# Altium schematic sheet Reference_Layout.SchDoc
size C; SheetNumber: 6; SheetTotal: 6
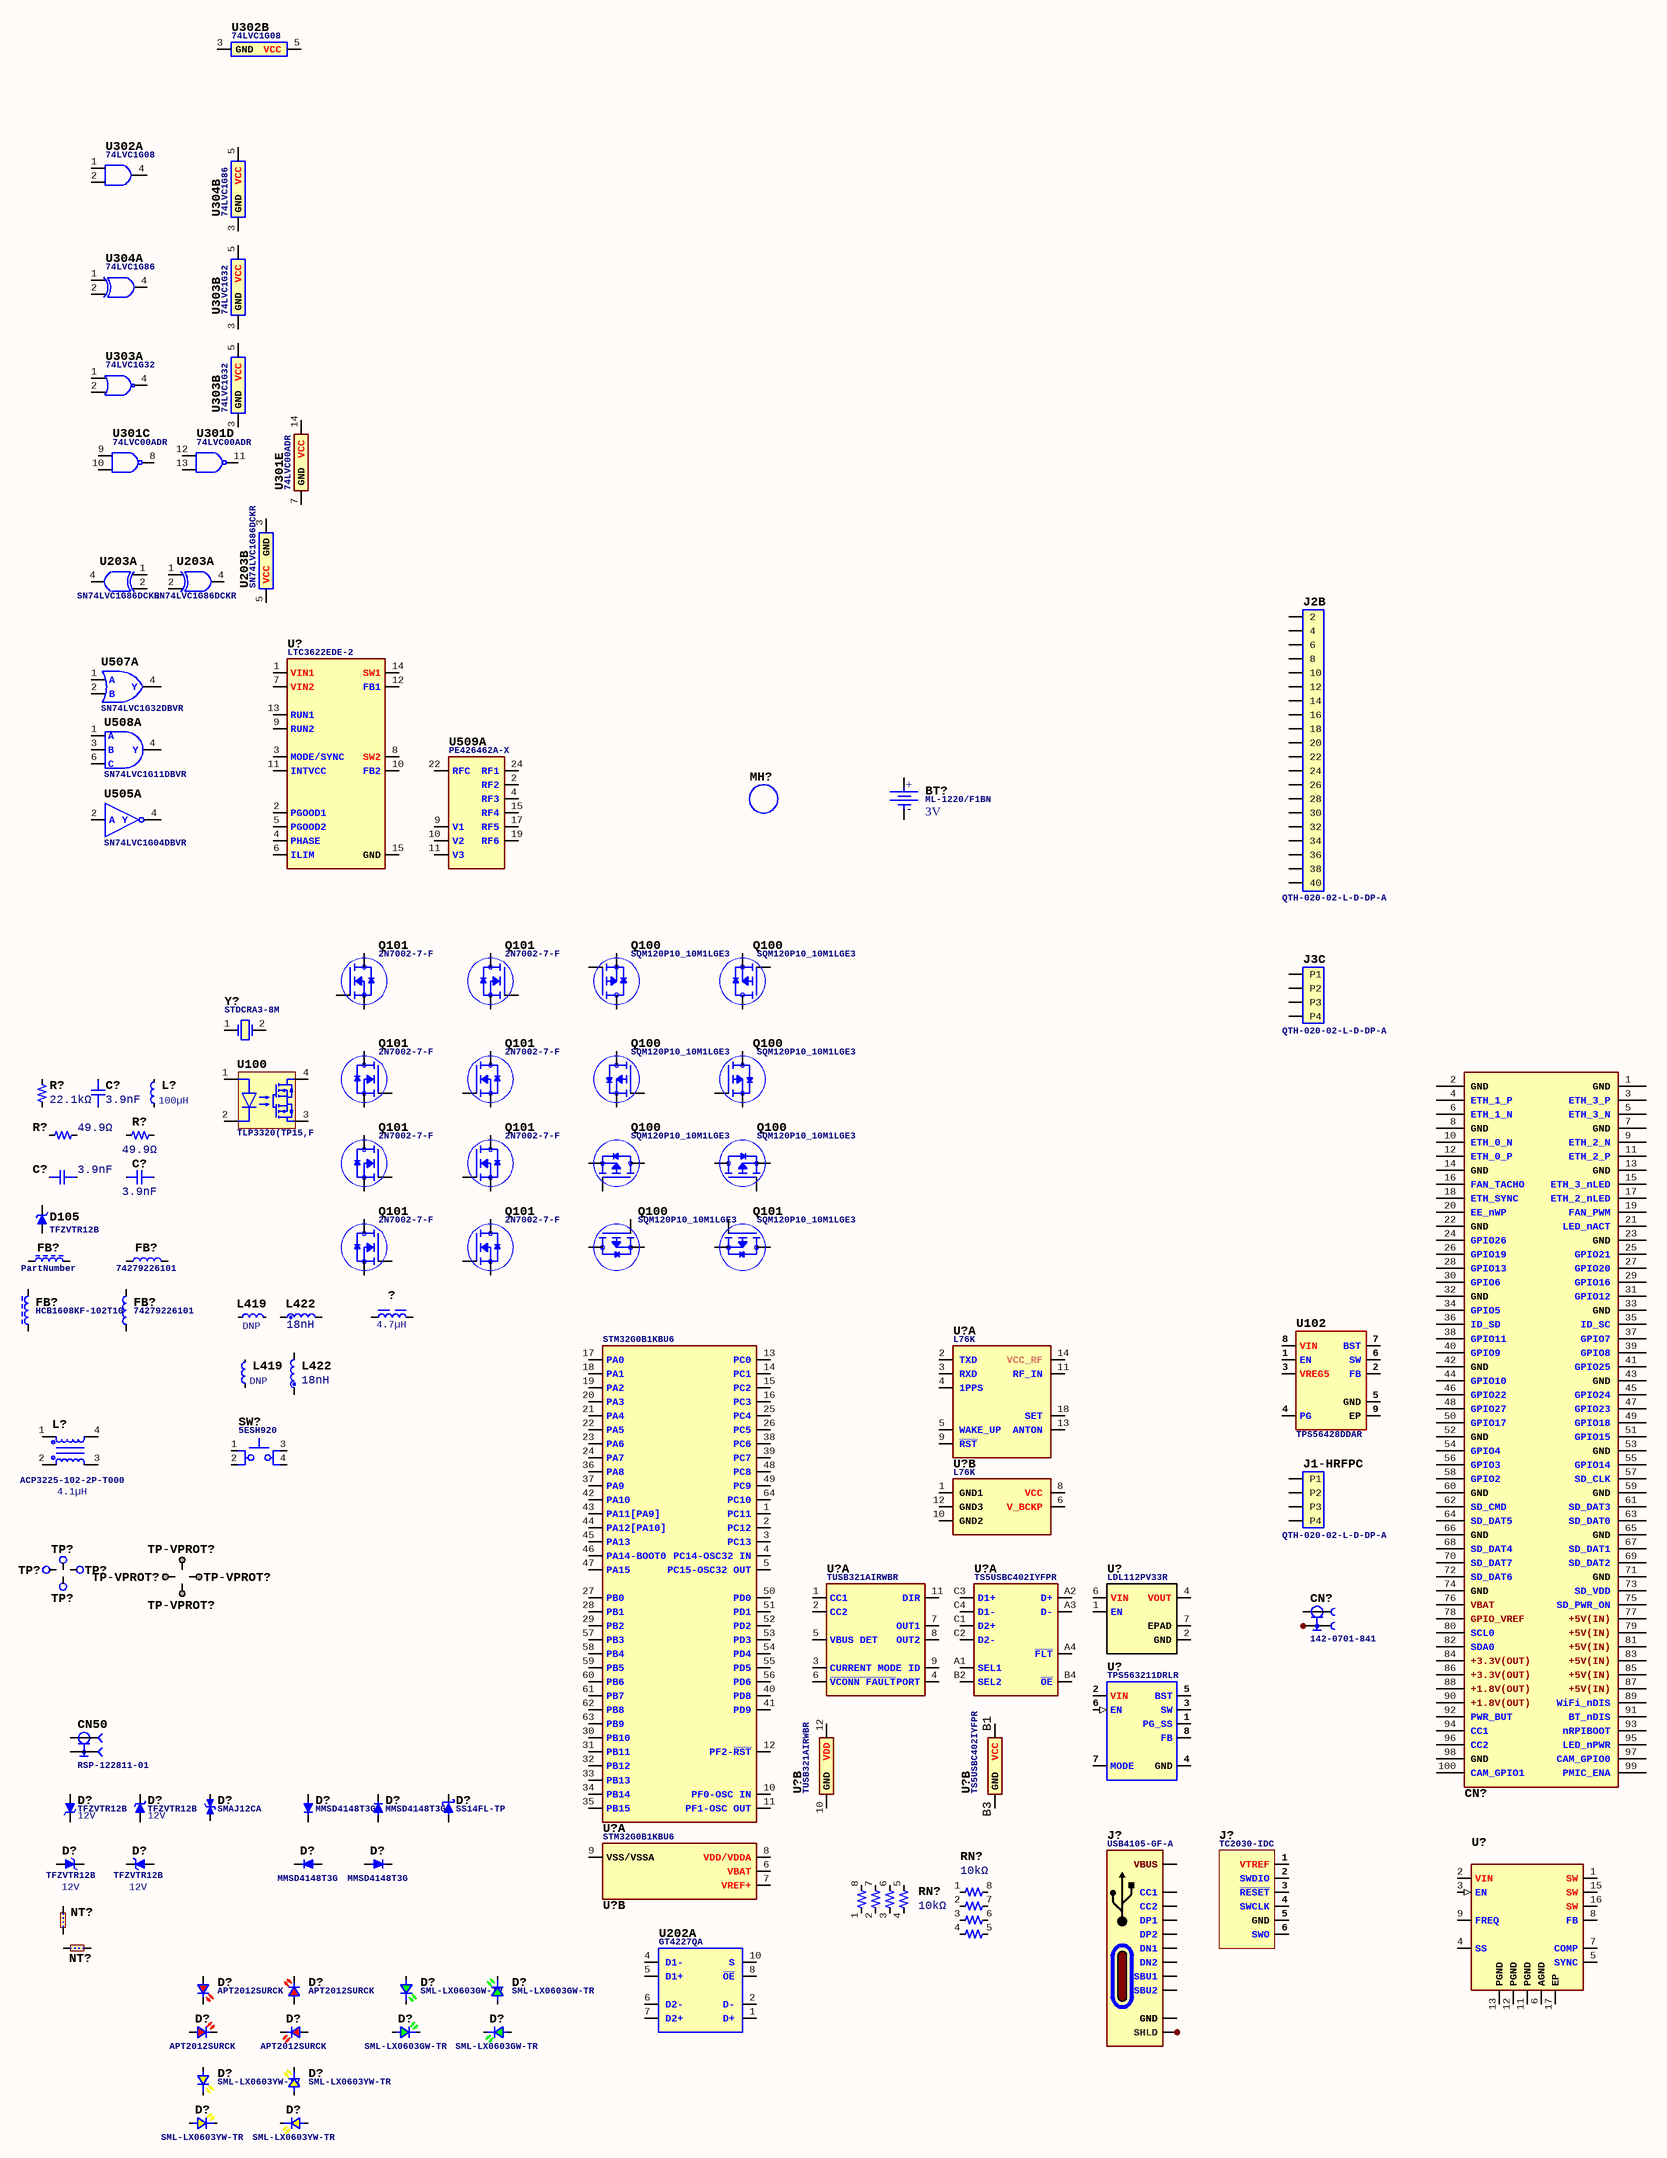
[diagram p0: Reference_Layout.SchDoc]

## Parts
(Parts that share a designator on the sheet are numbered #1, #2 ... from top to bottom, then left to right.)
?  Inductance: 4.7µH  [WE-HCI_7040]  (hidden comment: MN-IND-4.7µH-744311470)
BT?  Voltage: 3V  PartNumber: ML-1220/F1BN  [FP-ML-1220-F1BN-MFG]  (hidden comment: MN-BAT-LITH-ML-1220/F1BN)
C?#1  Capacitance: 3.9nF  [CAPC0805(2012)145_L]  (hidden comment: MN-CAP-CERM-C0G-0805-3.9nF-50V-5%)
C?#2  Capacitance: 3.9nF  [CAPC0805(2012)145_L]  (hidden comment: MN-CAP-CERM-C0G-0805-3.9nF-50V-5%)
C?#3  Capacitance: 3.9nF  [CAPC0805(2012)145_L]  (hidden comment: MN-CAP-CERM-C0G-0805-3.9nF-50V-5%)
CN50  PartNumber: RSP-122811-01  [MN-FP-UF.L-SAMTEC_RSP-122811-01-Footprint-1]  (hidden comment: MN-CON-U.FL-RSP-122811-01)
CN?#1  MN-SOM-RPI-CM5  [RPi-CM5-Footprint]  (value not drawn)
CN?#2  PartNumber: 142-0701-841  [MN-PCB-142-0701-841-Footprint-1]  (hidden comment: MN-CON-SMA-142-0701-841)
D105  PartNumber: TFZVTR12B  [SOD-323HE]  (hidden comment: MN-DIO-ZENER-12V)
D?#1  PartNumber: TFZVTR12B  Zener Voltage: 12V  [SOD-323HE]  (hidden comment: MN-DIO-ZENER-12V)
D?#2  PartNumber: MMSD4148T3G  [FP-SOD-123]  (hidden comment: MN-DIO-MMSD4148T3G)
D?#3  PartNumber: SMAJ12CA  [FP-DO-214AC-SMAJ]  (hidden comment: MN-DIO-TVS-SMAJ12CA)
D?#4  PartNumber: TFZVTR12B  Zener Voltage: 12V  [SOD-323HE]  (hidden comment: MN-DIO-ZENER-12V)
D?#5  PartNumber: MMSD4148T3G  [FP-SOD-123]  (hidden comment: MN-DIO-MMSD4148T3G)
D?#6  PartNumber: SS14FL-TP  [FP-DO-221AC]  (hidden comment: MN-DIO-SCHOTTKY-SS14FL-TP)
D?#7  PartNumber: TFZVTR12B  Zener Voltage: 12V  [SOD-323HE]  (hidden comment: MN-DIO-ZENER-12V)
D?#8  PartNumber: TFZVTR12B  Zener Voltage: 12V  [SOD-323HE]  (hidden comment: MN-DIO-ZENER-12V)
D?#9  PartNumber: MMSD4148T3G  [FP-SOD-123]  (hidden comment: MN-DIO-MMSD4148T3G)
D?#10  PartNumber: MMSD4148T3G  [FP-SOD-123]  (hidden comment: MN-DIO-MMSD4148T3G)
D?#11  PartNumber: APT2012SURCK  [LEDC2012X05N]  (hidden comment: MN-LED-0805-RED)
D?#12  PartNumber: SML-LX0603GW-TR  [LEDC1608X08N]  (hidden comment: MN-LED-0602-GRN)
D?#13  PartNumber: APT2012SURCK  [LEDC2012X05N]  (hidden comment: MN-LED-0805-RED)
D?#14  PartNumber: SML-LX0603GW-TR  [LEDC1608X08N]  (hidden comment: MN-LED-0602-GRN)
D?#15  PartNumber: APT2012SURCK  [LEDC2012X05N]  (hidden comment: MN-LED-0805-RED)
D?#16  PartNumber: APT2012SURCK  [LEDC2012X05N]  (hidden comment: MN-LED-0805-RED)
D?#17  PartNumber: SML-LX0603GW-TR  [LEDC1608X08N]  (hidden comment: MN-LED-0602-GRN)
D?#18  PartNumber: SML-LX0603GW-TR  [LEDC1608X08N]  (hidden comment: MN-LED-0602-GRN)
D?#19  PartNumber: SML-LX0603YW-TR  [LEDC1608X08N]  (hidden comment: MN-LED-0602-YEL)
D?#20  PartNumber: SML-LX0603YW-TR  [LEDC1608X08N]  (hidden comment: MN-LED-0602-YEL)
D?#21  PartNumber: SML-LX0603YW-TR  [LEDC1608X08N]  (hidden comment: MN-LED-0602-YEL)
D?#22  PartNumber: SML-LX0603YW-TR  [LEDC1608X08N]  (hidden comment: MN-LED-0602-YEL)
FB?#1  MN-FB-1A-1KΩ-100MHz  [FP-BLM18-0_15-t0_8-IPC_B]  (value not drawn)
FB?#2  PartNumber: 74279226101  [WE-MPSB_1812_L4.5W3.2H2.3]  (hidden comment: MN-IND-FB-74279226101)
FB?#3  PartNumber: HCB1608KF-102T10  [FP-BLM18-0_15-t0_8-IPC_B]  (hidden comment: MN-FB-1A-1KΩ-100MHz)
FB?#4  PartNumber: 74279226101  [WE-MPSB_1812_L4.5W3.2H2.3]  (hidden comment: MN-IND-FB-74279226101)
J1-HRFP  PartNumber: QTH-020-02-L-D-DP-A  [FP-QTH-020-02-L-D-DP-A-MFG_16mm]  (hidden comment: MN-CON-SAMTEC-QTH-020-02-L-D-DP-A)  (part C of 3)
J2  PartNumber: QTH-020-02-L-D-DP-A  [FP-QTH-020-02-L-D-DP-A-MFG_16mm]  (hidden comment: MN-CON-SAMTEC-QTH-020-02-L-D-DP-A)  (part B of 3)
J3  PartNumber: QTH-020-02-L-D-DP-A  [FP-QTH-020-02-L-D-DP-A-MFG_16mm]  (hidden comment: MN-CON-SAMTEC-QTH-020-02-L-D-DP-A)  (part C of 3)
J?#1  PartNumber: USB4105-GF-A  [MN-CON-USB-USB4105-GF-A-Footprint-1]  (hidden comment: MN-CON-USB-USB4105-GF-A)
J?#2  PartNumber: TC2030-IDC  [TC2030-IDC-Footprint]  (hidden comment: MN-CON-DBG-TC2030-IDC)  (no BOM)
L419#1  Inductance: DNP  [FP-IND_0805]  (hidden comment: MN-IND-DNP-0805)
L419#2  Inductance: DNP  [FP-IND_0805]  (hidden comment: MN-IND-DNP-0805)
L422#1  Inductance: 18nH  [FP-INDC0201(0603)_N]  (hidden comment: MN-IND-18nH-0201)
L422#2  Inductance: 18nH  [FP-INDC0201(0603)_N]  (hidden comment: MN-IND-18nH-0201)
L?#1  value 100µH  [FP-IND_0805]  (hidden comment: MN-IND-100µH-0805)
L?#2  PartNumber: ACP3225-102-2P-T000  Inductance: 4.1µH  [FP-ACP3225-MFG]  (hidden comment: MN-IND-ACP3225-102-2P-T000)
MH?  MN-PCB-MH-M3-PLATED  [PCB_MH_M3-PLATED-Footprint-1]  (value not drawn)  (no BOM)
NT?#1  MN-PCB-NETTIE  [Net-Tie_10milWide_30milLong]  (value not drawn)  (net tie, no BOM)
NT?#2  MN-PCB-NETTIE  [Net-Tie_10milWide_30milLong]  (value not drawn)  (net tie, no BOM)
Q100#1  PartNumber: SQM120P10_10M1LGE3  [FP-TO-263-3, D2PAK]  (hidden comment: MN-TRN-MOSFET-P_CH-100V-120A-SQM120P10_10M1LGE3)
Q100#2  PartNumber: SQM120P10_10M1LGE3  [FP-TO-263-3, D2PAK]  (hidden comment: MN-TRN-MOSFET-P_CH-100V-120A-SQM120P10_10M1LGE3)
Q100#3  PartNumber: SQM120P10_10M1LGE3  [FP-TO-263-3, D2PAK]  (hidden comment: MN-TRN-MOSFET-P_CH-100V-120A-SQM120P10_10M1LGE3)
Q100#4  PartNumber: SQM120P10_10M1LGE3  [FP-TO-263-3, D2PAK]  (hidden comment: MN-TRN-MOSFET-P_CH-100V-120A-SQM120P10_10M1LGE3)
Q100#5  PartNumber: SQM120P10_10M1LGE3  [FP-TO-263-3, D2PAK]  (hidden comment: MN-TRN-MOSFET-P_CH-100V-120A-SQM120P10_10M1LGE3)
Q100#6  PartNumber: SQM120P10_10M1LGE3  [FP-TO-263-3, D2PAK]  (hidden comment: MN-TRN-MOSFET-P_CH-100V-120A-SQM120P10_10M1LGE3)
Q100#7  PartNumber: SQM120P10_10M1LGE3  [FP-TO-263-3, D2PAK]  (hidden comment: MN-TRN-MOSFET-P_CH-100V-120A-SQM120P10_10M1LGE3)
Q101#1  PartNumber: 2N7002-7-F  [NXP-SOT23-3_V]  (hidden comment: MN-TRN-MOSFET-N_CH_60V-115mA-2N7002-7-F)
Q101#2  PartNumber: 2N7002-7-F  [NXP-SOT23-3_V]  (hidden comment: MN-TRN-MOSFET-N_CH_60V-115mA-2N7002-7-F)
Q101#3  PartNumber: 2N7002-7-F  [NXP-SOT23-3_V]  (hidden comment: MN-TRN-MOSFET-N_CH_60V-115mA-2N7002-7-F)
Q101#4  PartNumber: 2N7002-7-F  [NXP-SOT23-3_V]  (hidden comment: MN-TRN-MOSFET-N_CH_60V-115mA-2N7002-7-F)
Q101#5  PartNumber: 2N7002-7-F  [NXP-SOT23-3_V]  (hidden comment: MN-TRN-MOSFET-N_CH_60V-115mA-2N7002-7-F)
Q101#6  PartNumber: 2N7002-7-F  [NXP-SOT23-3_V]  (hidden comment: MN-TRN-MOSFET-N_CH_60V-115mA-2N7002-7-F)
Q101#7  PartNumber: SQM120P10_10M1LGE3  [FP-TO-263-3, D2PAK]  (hidden comment: MN-TRN-MOSFET-P_CH-100V-120A-SQM120P10_10M1LGE3)
Q101#8  PartNumber: 2N7002-7-F  [NXP-SOT23-3_V]  (hidden comment: MN-TRN-MOSFET-N_CH_60V-115mA-2N7002-7-F)
Q101#9  PartNumber: 2N7002-7-F  [NXP-SOT23-3_V]  (hidden comment: MN-TRN-MOSFET-N_CH_60V-115mA-2N7002-7-F)
R?#1  Resistance: 22.1kΩ  [RESC0402(1005)]  (hidden comment: MN-RES-0402-22.1KΩ-1/10W)
R?#2  Resistance: 49.9Ω  [RESC0402(1005)]  (hidden comment: MN-RES-0402-49.9Ω-1/16W)
R?#3  Resistance: 49.9Ω  [RESC0402(1005)]  (hidden comment: MN-RES-0402-49.9Ω-1/16W)
RN?#1  Resistance: 10kΩ  [FP-TC164-MFG]  (hidden comment: MN-RES-ARRAY-ISO-1206-10KΩ-1/16W)
RN?#2  Resistance: 10kΩ  [FP-TC164-MFG]  (hidden comment: MN-RES-ARRAY-ISO-1206-10KΩ-1/16W)
SW?  PartNumber: 5ESH920  [MN-PCB-SW-TACT-5ESH920-Footprint-1]  (hidden comment: MN-SW-TACT-5ESH920)
TP-VPROT?#1  MN-TPT-5019  [Keystone_5019]  (value not drawn)
TP-VPROT?#2  MN-TPT-5019  [Keystone_5019]  (value not drawn)
TP-VPROT?#3  MN-TPT-5019  [Keystone_5019]  (value not drawn)
TP-VPROT?#4  MN-TPT-5019  [Keystone_5019]  (value not drawn)
TP?#1  Standard Testpoint Pad  [MN-TPT-1MM-Footprint-1]  (value not drawn)
TP?#2  Standard Testpoint Pad  [MN-TPT-1MM-Footprint-1]  (value not drawn)
TP?#3  Standard Testpoint Pad  [MN-TPT-1MM-Footprint-1]  (value not drawn)
TP?#4  Standard Testpoint Pad  [MN-TPT-1MM-Footprint-1]  (value not drawn)
U100  PartNumber: TLP3320(TP15,F  [11-2C1S_MFG]  (hidden comment: MN-SW-OPTO_SSR-TLP3320(TP15,F)
U102  PartNumber: TPS56428DDAR  [FP-8-PowerSOIC(3.90mm)]  (hidden comment: MN-IC-PWR-TPS56428DDAR)
U202  GT4227QA  [GT4227QA-Footprint-1]  (part A of 2)
U203#1  PartNumber: SN74LVC1G86DCKR  [FP-DCK0005A-MFG]  (hidden comment: 74LVC1G86)  (parts A,B of 2)
U203#2  PartNumber: SN74LVC1G86DCKR  [FP-DCK0005A-MFG]  (hidden comment: 74LVC1G86)  (part A of 2)
U301  value 74LVC00ADR  [D0014A_N]  (hidden comment: 74HC00)  (parts C,D,E of 5)
U302  74LVC1G08  [FP-SOT-353]  (parts A,B of 2)
U303#1  value 74LVC1G32  [FP-DCK0005A-MFG]  (hidden comment: MN-IC-LOGIC-SN74LVC1G32)  (parts A,B of 2)
U303#2  value 74LVC1G32  [FP-DCK0005A-MFG]  (hidden comment: MN-IC-LOGIC-SN74LVC1G32)  (part B of 2)
U304  74LVC1G86  [FP-DCK0005A-MFG]  (parts A,B of 2)
U505  PartNumber: SN74LVC1G04DBVR  [FP-SOT-23-5]  (hidden comment: MN-IC-LOGIC-SN74LVC1G04DBVR)  (part A of 2)
U507  PartNumber: SN74LVC1G32DBVR  [FP-SOT-23-5]  (hidden comment: MN-IC-LOGIC-SN74LVC1G32DBVR)  (part A of 2)
U508  PartNumber: SN74LVC1G11DBVR  [SOT23-6_N]  (hidden comment: MN-IC-LOGIC-SN74LVC1G11DBVR)  (part A of 2)
U509  PartNumber: PE426462A-X  [PE42462A-X-Footprint-1]  (hidden comment: MN-IC-RFMUX-PE42462A-X)  (part A of 2)
U?#1  PartNumber: LTC3622EDE-2  [FP-14-DFN(4x3)]  (hidden comment: MN-IC-PWR-LTC3622EDE-2)
U?#2  PartNumber: STM32G0B1KBU6  [FP-64-LQFP(10x10)]  (hidden comment: MN-IC-MCU-STM32G071RBT6)  (part A of 2)
U?#3  PartNumber: L76K  [MN-SOM-GNS-L76K-Footprint-1]  (hidden comment: MN-SOM-GNS-L76K)  (part A of 2)
U?#4  PartNumber: L76K  [MN-SOM-GNS-L76K-Footprint-1]  (hidden comment: MN-SOM-GNS-L76K)  (part B of 2)
U?#5  PartNumber: TUSB321AIRWBR  [FP-RWB0012A-MFG]  (hidden comment: MN-IC-TUSB321AIRWBR)  (part A of 2)
U?#6  PartNumber: TS5USBC402IYFPR  [MN-IC-USB-TS5USBC410IYFFR-Footprint-1]  (hidden comment: MN-IC-USB-TS5USBC402IYFPR)  (part A of 2)
U?#7  PartNumber: LDL112PV33R  [FP-6DFN(3x3)-LDL112PV33R]  (hidden comment: MN-IC-PWR-LDL112PV33R)
U?#8  PartNumber: TPS563211DRLR  [TPS563211DRLR-Footprint-1]  (hidden comment: MN-IC-PWR-TPS563211DRLR)
U?#9  PartNumber: TUSB321AIRWBR  [FP-RWB0012A-MFG]  (hidden comment: MN-IC-TUSB321AIRWBR)  (part B of 2)
U?#10  PartNumber: TS5USBC402IYFPR  [MN-IC-USB-TS5USBC410IYFFR-Footprint-1]  (hidden comment: MN-IC-USB-TS5USBC402IYFPR)  (part B of 2)
U?#11  PartNumber: STM32G0B1KBU6  [FP-64-LQFP(10x10)]  (hidden comment: MN-IC-MCU-STM32G071RBT6)  (part B of 2)
U?#12  MN-IC-PWR-TPS55340QRTERQ1  [FP-16-WQFN(3x3)-RTE0016C]  (value not drawn)
Y?  PartNumber: STDCRA3-8M  [NDK-NX3225GD-8MHZ-STD-CRA-3_V]  (hidden comment: MN-XTAL-8.00MHz-NX3225GD)

## Nets
NetCN50_G1: CN50.G1 CN50.G2
NetCN?#2_G1: CN?#2.G1 CN?#2.G2 CN?#2.G3 CN?#2.G4
NetJ?#1_A1_B12: J?#1.A1_B12(GND) J?#1.B1_A12(GND)
NetJ?#1_A4_B9: J?#1.A4_B9(VBUS) J?#1.B4_A9(VBUS)
NetJ?#1_SH1: J?#1.SH1(SHLD) J?#1.SH2(SHLD) J?#1.SH3(SHLD) J?#1.SH4(SHLD)

Not connected (* = marked no-connect by the designer): ? 1 2 MP1 MP2; BT? 1(C) 2(A); C?#1 1 2; C?#2 1 2; C?#3 1 2; CN50 1 G3(2) G4(2); CN?#1 1(GND) 2(GND) 3(ETH_3_P) 4(ETH_1_P) 5(ETH_3_N) 6(ETH_1_N) 7(GND) 8(GND) 9(ETH_2_N) 10(ETH_0_N) 11(ETH_2_P) 12(ETH_0_P) 13(GND) 14(GND) 15(ETH_3_nLED) 16(FAN_TACHO) 17(ETH_2_nLED) 18(ETH_SYNC) 19(FAN_PWM) 20(EE_nWP) 21(LED_nACT) 22(GND) 23(GND) 24(GPIO26) 25(GPIO21) 26(GPIO19) 27(GPIO20) 28(GPIO13) 29(GPIO16) 30(GPIO6) 31(GPIO12) 32(GND) 33(GND) 34(GPIO5) 35(ID_SC) 36(ID_SD) 37(GPIO7) 38(GPIO11) 39(GPIO8) 40(GPIO9) 41(GPIO25) 42(GND) 43(GND) 44(GPIO10) 45(GPIO24) 46(GPIO22) 47(GPIO23) 48(GPIO27) 49(GPIO18) 50(GPIO17) 51(GPIO15) 52(GND) 53(GND) 54(GPIO4) 55(GPIO14) 56(GPIO3) 57(SD_CLK) 58(GPIO2) 59(GND) 60(GND) 61(SD_DAT3) 62(SD_CMD) 63(SD_DAT0) 64(SD_DAT5) 65(GND) 66(GND) 67(SD_DAT1) 68(SD_DAT4) 69(SD_DAT2) 70(SD_DAT7) 71(GND) 72(SD_DAT6) 73(SD_VDD) 74(GND) 75(SD_PWR_ON) 76(VBAT) 77(+5V(IN)) 78(GPIO_VREF) 79(+5V(IN)) 80(SCL0) 81(+5V(IN)) 82(SDA0) 83(+5V(IN)) 84(+3.3V(OUT)) 85(+5V(IN)) 86(+3.3V(OUT)) 87(+5V(IN)) 88(+1.8V(OUT)) 89(WiFi_nDIS) 90(+1.8V(OUT)) 91(BT_nDIS) 92(PWR_BUT) 93(nRPIBOOT) 94(CC1) 95(LED_nPWR) 96(CC2) 97(CAM_GPIO0) 98(GND) 99(PMIC_ENA) 100(CAM_GPIO1) Un1 Un2 Un3 Un4; CN?#2 1; D105 1(K) 2(A); D?#1 1(K) 2(A); D?#2 1(K) 2(A); D?#3 1(A1) 2(A2); D?#4 1(K) 2(A); D?#5 1(K) 2(A); D?#6 A K; D?#7 1(K) 2(A); D?#8 1(K) 2(A); D?#9 1(K) 2(A); D?#10 1(K) 2(A); D?#11 A K; D?#12 A K; D?#13 A K; D?#14 A K; D?#15 A K; D?#16 A K; D?#17 A K; D?#18 A K; D?#19 A K; D?#20 A K; D?#21 A K; D?#22 A K; FB?#1 1 2; FB?#2 1 2; FB?#3 1 2; FB?#4 1 2; J1-HRFP P1 P2 P3 P4; J2 2 4 6 8 10 12 14 16 18 20 22 24 26 28 30 32 34 36 38 40; J3 P1 P2 P3 P4; J?#1 A5(CC1) A6(DP1) A7(DN1) A8(SBU1) B5(CC2) B6(DP2) B7(DN2) B8(SBU2) MH1 MH2; J?#2 1(VTREF) 2(SWDIO) 3(~{RESET}) 4(SWCLK) 5(GND) 6(SWO); L419#1 1 2; L419#2 1 2; L422#1 1 2; L422#2 1 2; L?#1 1 2; L?#2 1 2 3 4; NT?#1 1 2; NT?#2 1 2; Q100#1 D G S; Q100#2 D G S; Q100#3 D G S; Q100#4 D G S; Q100#5 D G S; Q100#6 D G S; Q100#7 D G S; Q101#1 D G S; Q101#2 D G S; Q101#3 D G S; Q101#4 D G S; Q101#5 D G S; Q101#6 D G S; Q101#7 D G S; Q101#8 D G S; Q101#9 D G S; R?#1 1 2; R?#2 1 2; R?#3 1 2; RN?#1 1 2 3 4 5 6 7 8; RN?#2 1 2 3 4 5 6 7 8; SW? 1 2 3 4; TP-VPROT?#1 1; TP-VPROT?#2 1; TP-VPROT?#3 1; TP-VPROT?#4 1; TP?#1 1; TP?#2 1; TP?#3 1; TP?#4 1; U100 1(A) 2(K) 3(G1) 4(G2); U102 1(EN) 2(FB) 3(VREG5) 4(PG) 5(GND) 6(SW) 7(BST) 8(VIN) 9(EP); U202 1(D+) 2(D-) 4(D1-) 5(D1+) 6(D2-) 7(D2+) 8(~{OE}) 10(S); U203#1 1 2 3(GND) 4 5(VCC); U203#2 1 2 4; U301 7(GND) 8 9 10 11 12 13 14(VCC); U302 1 2 3(GND) 4 5(VCC); U303#1 1 2 3(GND) 4 5(VCC); U303#2 3(GND) 5(VCC); U304 1 2 3(GND) 4 5(VCC); U505 2(A) 4(Y); U507 1(A) 2(B) 4(Y); U508 1(A) 3(B) 4(Y) 6(C); U509 2(RF2) 4(RF3) 9(V1) 10(V2) 11(V3) 15(RF4) 17(RF5) 19(RF6) 22(RFC) 24(RF1); U?#1 1(VIN1) 2(PGOOD1) 3(MODE/SYNC) 4(PHASE) 5(PGOOD2) 6(ILIM) 7(VIN2) 8(SW2) 9(RUN2) 10(FB2) 11(INTVCC) 12(FB1) 13(RUN1) 14(SW1) 15(GND); U?#2 1(PC11) 2(PC12) 3(PC13) 4(PC14-OSC32_IN) 5(PC15-OSC32_OUT) 10(PF0-OSC_IN) 11(PF1-OSC_OUT) 12(PF2-~{RST}) 13(PC0) 14(PC1) 15(PC2) 16(PC3) 17(PA0) 18(PA1) 19(PA2) 20(PA3) 21(PA4) 22(PA5) 23(PA6) 24(PA7) 25(PC4) 26(PC5) 27(PB0) 28(PB1) 29(PB2) 30(PB10) 31(PB11) 32(PB12) 33(PB13) 34(PB14) 35(PB15) 36(PA8) 37(PA9) 38(PC6) 39(PC7) 40(PD8) 41(PD9) 42(PA10) 43(PA11[PA9]) 44(PA12[PA10]) 45(PA13) 46(PA14-BOOT0) 47(PA15) 48(PC8) 49(PC9) 50(PD0) 51(PD1) 52(PD2) 53(PD3) 54(PD4) 55(PD5) 56(PD6) 57(PB3) 58(PB4) 59(PB5) 60(PB6) 61(PB7) 62(PB8) 63(PB9) 64(PC10); U?#3 2(TXD) 3(RXD) 4(1PPS) 5(WAKE_UP) 7(RSVD) 9(~{RST}) 11(RF_IN) 13(ANTON) 14(VCC_RF) 15(RSVD2) 16(RSVD3) 17(RSVD4) 18(SET); U?#4 1(GND1) 6(V_BCKP) 8(VCC) 10(GND2) 12(GND3); U?#5 1(CC1) 2(CC2) 3(CURRENT_MODE) 4(PORT) 5(VBUS_DET) 6(~{VCONN_FAULT}) 7(OUT1) 8(OUT2) 9(ID) 11(DIR); U?#6 A1(SEL1) A2(D+) A3(D-) A4(~{FLT}) B2(SEL2) B4(~{OE}) C1(D2+) C2(D2-) C3(D1+) C4(D1-); U?#7 1(EN) 2(GND) 3(NC) 4(VOUT) 5(NC) 6(VIN) 7(EPAD); U?#8 1(PG_SS) 2(VIN) 3(SW) 4(GND) 5(BST) 6(EN) 7(MODE) 8(FB); U?#9 10(GND) 12(VDD); U?#10 B1(VCC) B3(GND); U?#11 6(VBAT) 7(VREF+) 8(VDD/VDDA) 9(VSS/VSSA); U?#12 1(SW) 2(VIN) 3(EN) 4(SS) 5(SYNC) 6(AGND) 7(COMP) 8(FB) 9(FREQ) 10(NC) 11(PGND) 12(PGND) 13(PGND) 14(NC) 15(SW) 16(SW) 17(EP); Y? 1 2

## Notes on the sheet
- (in symbol CMP-001-0003-2) +; -

## Library data of the parts
? = CMP-006-00034-2: FIXED IND 4.7UH 6A 19.5 MOHM SMD / WE-HCI SMD Flat Wire High Current Inductor; Manufacturer Lifecycle Status: ACTIVE; DC Resistance (DCR): 19.5mΩ; Shielding: Shielded; Test Frequency: 100kHz; Self Resonant Frequency: 33MHz; Saturation Current: 2.5A; ESR: 19.5Ω; Inductance Tolerance: 20%; Value: 4.7µH; PartNumber: 744311470; Width: 6.9mm; Composition: Wirewound; Depth: 6.9mm; Ambient Temperature Range Low: -40°C; Max DC Current: 6A; Mounting Technology: Surface Mount; Tolerance: 20%; Case/Package: Nonstandard; Current Rating: 6A; Pins: 2; Ambient Temperature Range High: 100°C; Max Operating Temperature: 150°C; RMS Current (Irms): 6A; Height - Seated (Max): 3.9878mm; Min Operating Temperature: -40°C; Termination: SMD/SMT; Length: 7mm; Height: 3.8mm
BT? = CMP-001-0003-2: Battery, Rechargeable, Coin/Button, Manganese Lithium, 3 VDC, 17mAh, Solder Tab; Approvals: IEC, UL; Number of Cells: 1; Chemistry/Technology: Lithium; RoHS: Compliant; Depth: 12.6mm; Manufacturer Package Identifier: ML-1220/F1BN; Mounting Technology: Holder, PCB; Height: 2mm; Voltage Rating: 3V; Lifecycle Status: Obsolete; Output Voltage: 3V; Min Operating Temperature: -20°C; Weight: 800mg; Length: 12.6mm; Diameter: 12.6mm; Lead Free: Lead Free; Max Operating Temperature: 60°C; Termination: Tab
C?#1 C?#3 = CMP-001-00091-10: CAP, CERM, 3.9 nF, 50 V, +/-5%, 0805, C0G; PartNumber: CGA4C2C0G1H392J060AA; Value: 3.9nF
C?#2 = CMP-001-00091-10: CAP, CERM, 3.9 nF, 50 V, +/-5%, 0805, C0G; PartNumber: CGA4C2C0G1H392J060AA; Value: 3.9nF; sch_layout_opt: 2
CN50 = CMP-002-00091-2: RF MHF Connector, 1 Contact(s), Male, Board Mount, Surface Mount Terminal, Receptacle; Impedance: 50Ω; Connector Type: SMD/SMT; Dielectric Material: Liquid Crystal Polymer; Gender: Female; Number of Contacts: 1; Voltage Rating: 60V; Frequency: 6GHz; Termination: Solder; Max Operating Temperature: 90°C; Case/Package: SMD/SMT; Min Operating Temperature: -40°C; Mounting Technology: Surface Mount; Orientation: Straight; Height: 1.44mm; Length: 3.1mm; Depth: 3mm
CN?#1 = CMP-001-0000-7: Raspberry PI Compute Module 5; PartNumber: 0164227-1001A1RLF; Contact Resistance: 90mΩ; Current Rating: 300mA; Gender: Female; Insulation Resistance: 50MΩ; Number of Positions: 100; Operating Force: 900mN; Pitch: 406.4µm; Row Spacing: 2.64mm; Insulation Color: Black; Max Operating Temperature: 125°C; Min Operating Temperature: -40°C; Number of Rows: 2; Orientation: Straight; Terminal Pitch: 400µm
CN?#2 = CMP-002-00087-4: RF SMA Connector, 1 Contact(s), Female, Board Mount, Surface Mount Terminal, Locking, Jack; Body Plating: Gold; Insulation Resistance: 5GΩ; Panel Thickness: 1.07mm; Body Material: Brass; Impedance: 50Ω; Contact Resistance: 4mΩ; Frequency: 18GHz; Polarity: Normal; Voltage Rating: 335V; Number of Positions: 1; Connector Type: Coaxial, PCB, SMA, Socket; Dielectric Material: PTFE; Termination: Solder; Length: 9.52mm; Housing Material: Brass; Contact Plating: Gold; Contact Material: Brass; Fastening Type: Threaded; Max Operating Temperature: 165°C; Gender: Female; Depth: 14.27mm; Case/Package: SMA; Voltage Rating (DC): 335V; Min Operating Temperature: -65°C; Mounting Technology: Edge, PCB, Through Hole; Working Voltage: 335V; Clock Frequency: 18GHz; Number of Ports: 1; Shell Material: Brass; Orientation: Straight
D105 = CMP-039-000002-10: TFZVTR12B Series 12 V 500 mW Surface Mount Zener Diode - TUMD2M; Reference Voltage: 12V; Max Power Dissipation: 500mW; Zener Current: 10mA; Voltage Tolerance: 2.51%; Impedance: 12Ω; Pins: 2; Zener Voltage: 12V; Max Operating Temperature: 150°C; Mounting Technology: Surface Mount; Case/Package: SOD-323HE
D?#1 D?#4 D?#7 D?#8 = CMP-039-000002-10: TFZVTR12B Series 12 V 500 mW Surface Mount Zener Diode - TUMD2M; Impedance: 12Ω; Max Power Dissipation: 500mW; Voltage Tolerance: 2.51%; Zener Current: 10mA; Case/Package: SOD-323HE; Max Operating Temperature: 150°C; Mounting Technology: Surface Mount; Pins: 2; Reference Voltage: 12V
D?#2 D?#5 D?#9 D?#10 = CMP-004-00036-3: MMSD4148T1 Series 100 V 200 mA Surface Mount Switching Diode - SOD-123; Peak Reverse Current: 5µA; Forward Current: 200mA; Element Configuration: Single; Polarity: Standard; Number of Elements: 1; Max Forward Surge Current (Ifsm): 2A; Max Power Dissipation: 425mW; Recovery Time: 4ns; Max Surge Current: 500mA; Max Reverse Voltage (DC): 100V; Forward Voltage: 1V; Reverse Standoff Voltage: 75V; Case/Package: SOD-123; Max Operating Temperature: 150°C; Width: 1.8mm; Length: 2.84mm; Current Rating: 200mA; Min Operating Temperature: -55°C; Number of Terminals: 2; Contact Plating: Tin; Average Rectified Current: 200mA; Peak Non-Repetitive Surge Current: 2A; Voltage Rating (DC): 100V; Max Repetitive Reverse Voltage (Vrrm): 100V; Power Dissipation: 425mW; Output Current: 200mA; Pins: 2; Max Output current: 200mA; Min Breakdown Voltage: 100V; Height: 1.25mm; Reverse Recovery Time: 4ns
D?#3 = CMP-004-00034-4: SMAJ Series 19.9 V 0.4 kW Surface Mount Bi-Directional TVS Diode - DO-214AC; Test Current: 1mA; Number of Bidirectional Channels: 1; Forward Voltage: 3.5V; Power Rating: 400W; Reverse Voltage: 12V; Max Output current: 20.1A; Max Junction Temperature (Tj): 150°C; Reverse Breakdown Voltage: 13.3V; Polarity: Bidirectional; Element Configuration: Single; Breakdown Voltage: 14V; Max Reverse Leakage Current: 1µA; Clamping Voltage: 19.9V; Max Power Dissipation: 3.3W; Max Breakdown Voltage: 14.7V; Capacitance: 800pF; Height: 2.29mm; Width: 2.79mm; Max Surge Current: 20.1A; Peak Pulse Power: 400W; Mounting Technology: Surface Mount; Operating Supply Voltage: 12V; Voltage Rating (DC): 12V; Number of Elements: 1; Number of Channels: 1; Composition: Zener; Peak Pulse Current: 20.1A; Number of Terminals: 2; Min Operating Temperature: -65°C; Max Operating Temperature: 150°C; Termination: SMD/SMT; Leakage Current: 1µA; Reverse Standoff Voltage: 12V; Min Breakdown Voltage: 13.3V; Length: 4.5mm; Peak Reverse Current: 1µA; Pins: 2; Direction: Bidirectional; Export Control Classification Number (ECCN) Code: EAR99; Case/Package: DO-214AC
D?#6 = CMP-004-00035-7: Diode Schottky Barrier Rectifier 40V 1A 2-Pin SOD-123F T/R; Peak Reverse Current: 100µA; Max Forward Surge Current (Ifsm): 30A; Max Junction Temperature (Tj): 125°C; Number of Elements: 1; Element Configuration: Single; Capacitance: 60pF; Reverse Recovery Time: 5.695ns; Max Repetitive Reverse Voltage (Vrrm): 40V; Reverse Standoff Voltage: 40V; Min Operating Temperature: -55°C; Reverse Voltage: 40V; Ratings: AEC-Q101; Case/Package: DO-221AC; Mounting Technology: Surface Mount; Max Reverse Voltage (DC): 40V; Max Operating Temperature: 150°C; Average Rectified Current: 1A; Max Output current: 1A; Forward Current: 1A; Number of Terminals: 2; Height: 1.08mm
D?#11 D?#13 D?#15 D?#16 = CMP-039-000000-11: LED Uni-Color Red 645nm 2-Pin Chip 0805(2012Metric) T/R; Forward Current: 30mA; Forward Voltage: 2.5V; Lens Style: Clear; Luminous Intensity: 150mcd; Peak Wavelength: 650nm; Power Rating: 75mW; Viewing Angle: 120°; Wavelength: 635nm; Case Code (Imperial): 0805; Case Code (Metric): 2012; Case/Package: 0805; Color: Red; Height: 750µm; Illumination Color: Red; Length: 2mm; Mounting Technology: Surface Mount; Terminal Pitch: 2.35mm; Width: 1.25mm
D?#12 D?#14 D?#17 D?#18 = CMP-004-00032-5: LUMEX - SML-LX0603GW-TR - LED, QuasarBrite, Green, SMD, 0603, 20 mA, 2.2 V, 565 nm; Forward Current: 25mA; Forward Voltage: 2.4V; Lens Style: Diffused; Luminous Intensity: 18mcd; Peak Wavelength: 565nm; Viewing Angle: 160°; Number of Circuits: 1; Power Dissipation: 48mW; Lens Color: White; Test Current: 20mA; Shape: Rectangular; Case Code (Imperial): 0603; Case Code (Metric): 1608; Case/Package: 0603; Color: Green; Height: 600µm; Illumination Color: Green; Length: 1.6mm; Mounting Technology: Surface Mount; Terminal Pitch: 1.5mm; Wavelength: 565nm; Width: 800µm; Number of LEDs: 1; Output Current: 25mA; Number of Terminals: 2; Max Operating Temperature: 85°C; Min Operating Temperature: -25°C; Pins: 2; Dominant Wavelength: 565nm; Introduction Date: 2000-06-01; Lens Transparency: Diffused
D?#19-D?#22 = CMP-004-00033-4: LED Uni-Color Yellow 585nm 2-Pin Chip 0603(1608Metric) T/R; Forward Current: 30mA; Forward Voltage: 2.6V; Lens Style: Diffused; Luminous Intensity: 14mcd; Viewing Angle: 160°; Number of Circuits: 1; Power Dissipation: 50mW; Lens Color: White; Test Current: 20mA; Shape: Rectangular; Reverse Voltage: 5V; Case Code (Imperial): 0603; Case Code (Metric): 1608; Case/Package: 0603; Color: Yellow; Illumination Color: Yellow; Length: 1.6mm; Mounting Technology: Surface Mount; Peak Wavelength: 585nm; Terminal Pitch: 1.5mm; Wavelength: 585nm; Width: 800µm; Number of LEDs: 1; Number of Terminals: 2; Max Operating Temperature: 85°C; Min Operating Temperature: -25°C; Pins: 2; Dominant Wavelength: 585nm; Lens Transparency: Diffused; Power Rating: 50mW
FB?#1 FB?#3 = CMP-006-00028-3: Ferrite Beads Multi-Layer Power 1KOhm 25% 100MHz 1A 0.2Ohm DCR 0603 T/R; Impedance: 1kΩ; ESR: 200mΩ; Number of Circuits: 1; Current Rating: 800mA; Core Material: Ferrite; Height: 800µm; Tolerance: 25%; Max Operating Temperature: 125°C; Length: 1.6mm; Mounting Technology: Surface Mount; Width: 800µm; Test Frequency: 100MHz; Resistance: 200mΩ; Number of Terminals: 2; Contact Plating: Tin; DC Resistance (DCR): 200mΩ; Min Operating Temperature: -55°C; Case/Package: 0603
  FB?#1: PartNumber: PartNumber
FB?#2 FB?#4 = CMP-006-00032-3: Ferrite Beads Multi-Layer Power 100Ohm 25% 100MHz 8A 0.006Ohm DCR 1812 Automotive T/R; Impedance: 100Ω; Number of Lines: 1; Frequency: 1.1GHz; Material: Ferrite, Steel; DC Resistance (DCR): 4.5mΩ; Case/Package: 1812; Length: 4.5mm; Test Frequency: 100MHz; Max Current Rating: 8A; Tolerance: 25%; Termination: SMD/SMT; Mounting Technology: Surface Mount; Max DC Current: 8A; Case Code (Metric): 4532; Case Code (Imperial): 1812; Current Rating: 8A; Max Operating Temperature: 125°C; Height: 2.3mm; Width: 3.2mm; Depth: 3.2mm; Min Operating Temperature: -55°C
J1-HRFP J2 J3 = CMP-002-00084-3: Board to Board & Mezzanine Connectors 0.50 mm Q Strip High-Speed Ground Plane Terminal Strip; Voltage Rating: 175V; Max Voltage Rating (AC): 125V; Pitch: 500µm; Gender: Male; Number of Contacts: 40; Contact Material: Gold, Nickel; Height: 7.347mm; Max Operating Temperature: 125°C; Orientation: Straight; Length: 20mm; Termination: Solder; Depth: 5.97mm; Contact Plating: Gold; Number of Rows: 2; Housing Material: Polymer; Min Operating Temperature: -55°C
J?#1 = CMP-002-00089-5: USB-C Connector, 16 Contact(s), Female, Right Angle, Surface Mount Terminal, Locking, Receptacle; Dielectric Material: Liquid Crystal Polymer; Row Spacing: 1.4mm; Number of Ports: 1; Number of Positions: 24; Current Rating: 6.25A; Contact Resistance: 50mΩ; Plating Thickness: 76.2nm; USB Standard: USB 2.0; Voltage Rating: 20V; Number of Rows: 1; Shell Finish: Nickel; Shell Material: Stainless Steel; Gender: Female; Min Operating Temperature: -40°C; Pins: 16; Terminal Pitch: 500µm; Max Operating Temperature: 85°C; Height: 3.46mm; Contact Material: Gold, Nickel; Orientation: Horizontal; Color: Black
J?#2 = CMP-002-00094-1: 6-pin spring-loaded "Plug-of-Nails™" contacts.
L419#1 L419#2 = CMP-006-00030-6: Footprint for DNP 0201 component for tuning; Number of Circuits: 1; Core Material: Ferrite; Current Rating: 140mA; Value: DNP; PartNumber: DNP; Case Code (Imperial): 0805; Case/Package: 0805; Mounting Technology: Surface Mount; Height: 1.25mm; Height - Seated (Max): 1.2446mm; Case Code (Metric): 2012; Width: 1.25mm; Length: 2mm; Termination: SMD/SMT; Number of Terminals: 2
L422#1 L422#2 = CMP-006-00044-1: Inductor RF Chip Thin Film 18nH 5% 500MHz 12Q-Factor 200mA 800mOhm DCR 0201 Paper T/R; PartNumber: LQP03TN18NJ02D; Shielding: Unshielded; Core Material: Non-Magnetic; Q Factor: 12; Self Resonant Frequency: 2.2GHz; ESR: 800mΩ; Number of Circuits: 1; RMS Current (Irms): 200mA; Mounting Technology: Surface Mount; Tolerance: 5%; Case/Package: 0201; Number of Terminals: 2; Composition: Thin Film; Test Frequency: 500MHz; REACH SVHC: Yes; Height: 300µm; DC Current: 200mA; Max Operating Temperature: 125°C; Max DC Current: 200mA; Current Rating: 200mA; Termination: SMD/SMT; Introduction Date: 2010-04-15; Max Current Rating: 200mA; Depth: 330µm; Min Operating Temperature: -55°C; DC Resistance (DCR): 800mΩ; Width: 300µm; Height - Seated (Max): 330.2µm; Case Code (Metric): 0603; Case Code (Imperial): 0201; Length: 600µm; Resistance: 800mΩ
L?#1 = CMP-006-00029-7: General Purpose Inductor, 100µH, 20%, 1 Element, Ferrite-Core, SMD, 0805; PartNumber: MLZ2012N101LTD25; Current Rating: 140mA; Saturation Current: 30mA; DC Resistance (DCR): 4.55Ω; Shielding: Shielded; Test Frequency: 2MHz; Number of Circuits: 1; Height: 1.25mm; Length: 2mm; Termination: SMD/SMT; Height - Seated (Max): 1.2446mm; Max Operating Temperature: 125°C; Min Operating Temperature: -55°C; Case/Package: 0805; Width: 1.25mm; Core Material: Ferrite; ESR: 4.55Ω; Max Current Rating: 140mA; Case Code (Metric): 2012; Ratings: AEC-Q200; RMS Current (Irms): 140mA; Tolerance: 20%; Case Code (Imperial): 0805; Number of Terminals: 2; Mounting Technology: Surface Mount; Inductance: 100µH
L?#2 = CMP-006-00031-3: Common Mode Filter, ACP Series 1210 1000 Ohm 1.2 A 0.10 Ohm DCR 50 V SMT; Test Frequency: 1MHz; Max DC Current: 1.5A; Tolerance: 25%; Shielding: Shielded; Number of Circuits: 2; Frequency: 8.5GHz; Coil Resistance: 50mΩ; DC Resistance (DCR): 100mΩ; Impedance: 1kΩ; Voltage Rating: 60V; DC Current: 1.2A; Insulation Resistance: 10MΩ; Min Length: 3mm; Current: 1.5A; Current Rating: 1.5A; Case Code (Imperial): 1210; Min Operating Temperature: -40°C; Composition: Wirewound; Max Width: 2.7mm; Depth: 2.7mm; Height: 1.9mm; Case Code (Metric): 3225; Number of Lines: 2; Min Width: 2.3mm; Max Length: 3.4mm; Termination: SMD/SMT; Case/Package: 1210; Width: 2.5mm; Number of Terminals: 4; Max Operating Temperature: 85°C; Length: 3.2mm; Mounting Technology: Surface Mount; Inductance Tolerance: 25%; ESR: 100mΩ
MH? = CMP-032-000002-3: PCB Mounting Hole for M3 screw, with a plated thruhole; Design Item ID: CMP-00028-00013-1
NT?#1 NT?#2 = CMP-034-000000-2: Single point connection between nets.; Library Reference: Net-Tie; Available Preview Images: 2D; ClassName: PCB; Design Item ID: MN-PCB-NETTIE; Source: Schlib1.SchLib
Q100#1-Q100#5 Q100#7 Q101#7 = CMP-044-000000-7: Trans MOSFET P-CH 100V 120A Automotive AEC-Q101 3-Pin(2+Tab) D2PAK; Continuous Drain Current (ID): -120A; Drain to Source Breakdown Voltage: -100V; Drain to Source Resistance: 8.1mΩ; Gate to Source Voltage (Vgs): 20V; Max Junction Temperature (Tj): 175°C; Power Dissipation: 375W; Turn-Off Delay Time: 120ns; Turn-On Delay Time: 20ns; Case/Package: TO-263-3, D2PAK; Drain to Source Voltage (Vdss): -100V; Height: 5.08mm; Max Operating Temperature: 175°C; Min Operating Temperature: -55°C; Pins: 3
Q100#6 = CMP-044-000000-7: Trans MOSFET P-CH 100V 120A Automotive AEC-Q101 3-Pin(2+Tab) D2PAK; Drain to Source Resistance: 8.1mΩ; Drain to Source Voltage (Vdss): -100V; Max Junction Temperature (Tj): 175°C; Turn-Off Delay Time: 120ns; Gate to Source Voltage (Vgs): 20V; Turn-On Delay Time: 20ns; Power Dissipation: 375W; Continuous Drain Current (ID): -120A; Min Operating Temperature: -55°C; Case/Package: TO-263-3, D2PAK; Height: 5.08mm; Max Operating Temperature: 175°C; Pins: 3; Drain to Source Breakdown Voltage: -100V
Q101#1-Q101#6 Q101#8 Q101#9 = CMP-046-000000-6: N-channel Trench MOSFET, 60 V, 300 mA, -65 to 150 degC, 3-Pin SOT-23 (TO-236AB), RoHS, Tape and Reel; Voltage: 60V; Threshold Voltage: 2.5V; Fall Time: 5.6ns; Value: 7.5Ω; Current: 115A; Number of Elements: 1; Turn-On Delay Time: 2.8ns; Rise Time: 3ns; Drain to Source Breakdown Voltage: 70V; Max Junction Temperature (Tj): 150°C; Drain to Source Resistance: 13.5Ω; Turn-Off Delay Time: 7.6ns; Gate to Source Voltage (Vgs): 20V; Current Rating: 115mA; Power Dissipation: 370mW; Max Power Dissipation: 300mW; Input Capacitance: 50pF; Min Breakdown Voltage: 60V; Number of Terminals: 3; Drain to Source Voltage (Vdss): 60V; Max Operating Temperature: 150°C; Number of Channels: 1; Nominal Vgs: 2.5V; Min Operating Temperature: -55°C; Case/Package: SOT-23; Rds On Max: 7.5Ω; Width: 1.3mm; Pins: 3; Mounting Technology: Surface Mount; Length: 2.9mm; Height: 1.1mm
R?#1 = CMP-009-00190-9: Resistor, 22.1KΩ, 1%, 1/10W (100mW), 0402; PartNumber: CRCW040222K1FKED; Value: 22.1kΩ; Parameter 1: *
R?#2 = CMP-009-00191-9: Resistor, 49.9Ω, 1%, 1/16W (66mW), 0402; PartNumber: CRCW040249R9FKED; sch_layout_opt: 2; Value: *
R?#3 = CMP-009-00191-9: Resistor, 49.9Ω, 1%, 1/16W (66mW), 0402; PartNumber: CRCW040249R9FKED; Value: *
RN?#1 RN?#2 = CMP-009-00254-2: Resistor Array, x4, Isolated, 10KΩ, 5%, 1/16W (66mW), 1210; PartNumber: TC164-JR-0710KL; Number of Elements: 1; Working Voltage: 50V; Number of Resistors: 4; Number of Contacts: 8; Power Rating: 62.5mW; Temperature Coefficient: 200ppm/°C; Country of Origin: Mainland China, Taiwan; Composition: Thick Film; Width: 3.2mm; Lifecycle Status: Production; Case/Package: 0612; Circuit Type: Isolated; Voltage Rating (AC): 50V; Voltage Rating (DC): 50V; Min Operating Temperature: -55°C; Depth: 1.6mm; Number of Circuits: 4; Value: 10kΩ; Number of Terminals: 8; Max Operating Temperature: 155°C; Terminal Pitch: 800µm; Packaging: Cut Tape; Tolerance: 5%; Height: 600µm; Mounting Technology: Surface Mount; Power Dissipation: 62.5mW; Termination: Concave; Case Code (Imperial): 1206; China RoHS: Non-Compliant; Ratings: AEC-Q200; Length: 1.6mm; Pins: 8; Case Code (Metric): 3216; Voltage Rating: 50V
SW? = CMP-011-00014-4: Switch Tactile OFF (ON) SPST Button Gull Wing 0.05A 24VDC 10000000Cycles 2N SMD; Sealable: IP67; Number of Positions: 1; Contact Resistance: 30mΩ; Max Current Rating: 50mA; Max Voltage Rating (DC): 24V; Min Operating Temperature: -40°C; Operating Force: 2N; Height: 6.4mm; Throw Configuration: SPST; Max Operating Temperature: 160°C; Length: 10.1mm
TP-VPROT?#1-TP-VPROT?#4 = CMP-033-000000-6: Test Point, Miniature, SMT; PartNumber: 5019 Keystone; Height: 2.42mm; Pins: 1; Material: Bronze; Mounting Technology: Surface Mount
TP?#1-TP?#4 = CMP-071-000000-5: 1mm Test Point, Pad; Pin Count: 1; Source: RfBoard.SCHLIB; Component Type: Standard; Design Item ID: TestPoint
U100 = CMP-011-00013-2: Solid State Relays - PCB Mount MOSFET 1-Form-A Voff=100V .1A 14Ohm; Forward Current: 20mA; Max Junction Temperature (Tj): 125°C; Number of Contacts: 1; Capacitance: 6pF; Data Polarity: DC; Isolation Voltage: 1000Vrms; Input Current: 5mA; On-State Resistance: 14Ω; Pins: 4; Case/Package: SOIC; Width: 4.8mm; Thickness: 2.1mm; Height: 1.85mm; Length: 3.51mm; Min Operating Temperature: -20°C; Number of Elements: 1; Max Operating Temperature: 65°C; Max Length: 2.85mm; Mounting Technology: Surface Mount
U102 = CMP-019-00055-6: Switching Regulator, Voltage-mode, 4A, 650kHz Switching Freq-Max, BICMOS, PDSO8; Manufacturer Lifecycle Status: ACTIVE; Min Output Voltage: 600mV; Output Voltage: 7V; Max Supply Voltage: 18V; Synchronous Rectifier: Yes; Min Input Voltage: 4.5V; Quiescent Current: 250µA; Number of Outputs: 1; Topology: Buck; Output Configuration: Positive; Output Type: Adjustable; Switching Frequency: 650kHz; Radiation Hardening: No; Max Output current: 4A; Pins: 8; Max Operating Temperature: 85°C; Height: 1.7mm; Output Current: 4A; Thickness: 1.48mm; Max Output Voltage: 7V; Lead Free: Lead Free; Width: 3.9mm; Operating Supply Voltage: 18V; Mounting Technology: Surface Mount; Min Operating Temperature: -40°C; Length: 4.89mm; Case/Package: 8-PowerSOIC (3.90mm)
U202 = CMP-009-00267-2: High Speed Analog Switch; JLPCB: C42414468; PartNumber: GT4227QA; Footprint: praline:GTIC_UQFN-10_1.4x1.8mm_P0.4mm; Case/Package: QFN-10L(1.4x1.8); URL: https://jlcpcb.com/parts/componentSearch?searchTxt=GT4227QA
U203#1 U203#2 = CMP-009-00260-3: Single 2-input, 1.65-V to 5.5-V XOR (exclusive OR) gate 5-SC70 -40 to 125; High Level Output Current: -32mA; Low Level Output Current: 32mA; Max Junction Temperature (Tj): 150°C; Nominal Supply Current: 15µA; Number of Bits: 1; Number of Input Lines: 2; Propagation Delay: 5ns; Quiescent Current: 10µA; Schmitt Trigger Input: No; Min Supply Voltage (DC): 1.65V; Footprint: Package_TO_SOT_SMD:SOT-353_SC-70-5; Ambient Temperature Range High: 125°C; Case/Package: SC; Contact Plating: Gold; Height: 1.1mm; Length: 2mm; Logic Function: XOR; Max Operating Temperature: 125°C; Max Output current: 32mA; Min Operating Temperature: -40°C; Mounting Technology: Surface Mount; Number of Channels: 1; Number of Circuits: 1; Number of Elements: 1; Number of Gates: 1; Number of Inputs: 2; Number of Output Lines: 1; Number of Outputs: 1; Output Current: 32mA; Pins: 5; Termination: SMD/SMT; Thickness: 900µm; Turn-On Delay Time: 5ns; Width: 1.25mm
U301 = CMP-009-00256-4: NAND 74LVC00 EAR99 74LVC logic gate circuit 4.1ns @ 3.3V 50pF 1.75mm 24mA 24mA 3.6V; PartNumber: SN74LVC00ADR; High Level Output Current: -24mA; Min Supply Voltage: 1.65V; Number of Bits: 4; Number of Input Lines: 2; Number of Output Lines: 1; Quiescent Current: 1µA; Schmitt Trigger Input: No; Turn-On Delay Time: 4.3ns; Case/Package: SOIC; Contact Plating: Gold; Height: 0m; Length: 8.65mm; Logic Function: NAND; Low Level Output Current: 24mA; Max Operating Temperature: 125°C; Max Supply Voltage: 3.6V; Min Operating Temperature: -40°C; Mounting Technology: Surface Mount; Number of Circuits: 4; Number of Elements: 4; Number of Gates: 4; Number of Inputs: 2; Number of Outputs: 1; Output Current: 24mA; Pins: 14; Propagation Delay: 4.1ns; Thickness: 1.58mm; Width: 3.91mm
U302 = CMP-009-00258-2: Ic, And Gate, Single 2-Input, Smd, Reel;; PartNumber: SN74LVC1G08DCKR; Manufacturer Lifecycle Status: ACTIVE; High Level Output Current: -32mA; Low Level Output Current: 32mA; Max Supply Voltage: 5.5V; Min Supply Voltage: 1.65V; Number of Bits: 1; Number of Input Lines: 2; Propagation Delay: 4ns; Quiescent Current: 10µA; Schmitt Trigger Input: No; Footprint: Package_TO_SOT_SMD:SOT-353_SC-70-5; Case/Package: FP-SOT-353; Contact Plating: Gold; Height: 1.1mm; Length: 2mm; Logic Function: AND; Max Operating Temperature: 125°C; Max Output current: 32mA; Min Operating Temperature: -40°C; Mounting Technology: Surface Mount; Number of Channels: 1; Number of Circuits: 1; Number of Elements: 1; Number of Gates: 1; Number of Inputs: 2; Number of Output Lines: 1; Number of Outputs: 1; Output Current: 32mA; Pins: 5; Termination: SMD/SMT; Thickness: 900µm; Turn-On Delay Time: 4ns; Width: 1.25mm; JLCPCB: C7832; Radiation Hardening: No; REACH SVHC: No; Value: 74LVC1G08
U303#1 U303#2 = CMP-009-00259-3: SINGLE 2-INPUT POSITIVE-OR GATE OR Gate, LVC/LCX/Z Series, 1-Func, 2-Input, CMOS, PDSO5; PartNumber: SN74LVC1G32DCKR; High Level Output Current: -32mA; Low Level Output Current: 32mA; Max Junction Temperature (Tj): 150°C; Max Supply Voltage: 5.5V; Min Supply Voltage: 1.65V; Nominal Supply Current: 10µA; Number of Bits: 1; Number of Input Lines: 2; Propagation Delay: 3.4ns; Schmitt Trigger Input: No; Turn-On Delay Time: 4.5ns; Ambient Temperature Range High: 125°C; Case/Package: SC; Contact Plating: Gold; Height: 1.1mm; Length: 2mm; Logic Function: OR; Max Operating Temperature: 125°C; Max Output current: 32mA; Min Operating Temperature: -40°C; Mounting Technology: Surface Mount; Number of Channels: 1; Number of Circuits: 1; Number of Elements: 1; Number of Gates: 1; Number of Inputs: 2; Number of Output Lines: 1; Number of Outputs: 1; Output Current: 32mA; Pins: 5; Quiescent Current: 10µA; Termination: SMD/SMT; Thickness: 900µm; Width: 1.25mm; Packaging: Cut Tape; Radiation Hardening: No; REACH SVHC: No; Min Supply Voltage (DC): 1.65V
U304 = CMP-009-00260-3: Single 2-input, 1.65-V to 5.5-V XOR (exclusive OR) gate 5-SC70 -40 to 125; PartNumber: SN74LVC1G86DCKR; High Level Output Current: -32mA; Low Level Output Current: 32mA; Max Junction Temperature (Tj): 150°C; Nominal Supply Current: 15µA; Number of Bits: 1; Number of Input Lines: 2; Propagation Delay: 5ns; Quiescent Current: 10µA; Schmitt Trigger Input: No; Min Supply Voltage (DC): 1.65V; Footprint: Package_TO_SOT_SMD:SOT-353_SC-70-5; Ambient Temperature Range High: 125°C; Case/Package: SC; Contact Plating: Gold; Height: 1.1mm; Length: 2mm; Logic Function: XOR; Max Operating Temperature: 125°C; Max Output current: 32mA; Min Operating Temperature: -40°C; Mounting Technology: Surface Mount; Number of Channels: 1; Number of Circuits: 1; Number of Elements: 1; Number of Gates: 1; Number of Inputs: 2; Number of Output Lines: 1; Number of Outputs: 1; Output Current: 32mA; Pins: 5; Termination: SMD/SMT; Thickness: 900µm; Turn-On Delay Time: 5ns; Width: 1.25mm; Value: 74LVC1G86
U505 = CMP-016-00013-3: SINGLE INVERTER GATE Inverter, LVC/LCX/Z Series, 1-Func, 1-Input, CMOS, PDSO5; Manufacturer Lifecycle Status: ACTIVE; Number of Circuits: 1; Low Level Output Current: 32mA; Propagation Delay: 3.7ns; Logic Function: Inverting; Schmitt Trigger Input: No; Min Supply Voltage: 1.65V; Nominal Supply Current: 10µA; Frequency: 150MHz; High Level Output Current: -32mA; Max Supply Voltage: 5.5V; Turn-On Delay Time: 7.5ns; Number of Outputs: 1; Ambient Temperature Range High: 125°C; Mounting Technology: Surface Mount; Termination: SMD/SMT; Number of Gates: 1; Quiescent Current: 10µA; Max Operating Temperature: 125°C; Pins: 5; Number of Bits: 1; Output Current: 32mA; Length: 2.9mm; Max Output current: 32mA; Min Operating Temperature: -40°C; Case/Package: SOT-23; Height: 1.45mm; Contact Plating: Tin; Number of Elements: 1; Width: 1.6mm; Thickness: 1.2mm; Number of Inputs: 1; Number of Channels: 1
U507 = CMP-016-00012-5: 1-ch, 2-input 1.65-V to 5.5-V 32-mA drive strength OR gate 5-SOT-23 -40 to 125; Manufacturer Lifecycle Status: ACTIVE; Propagation Delay: 4.5ns; Max Junction Temperature (Tj): 150°C; Number of Inputs: 2; Max Supply Voltage: 5.5V; Number of Bits: 1; Nominal Supply Current: 10µA; High Level Output Current: -32mA; Operating Supply Voltage: 5V; Low Level Output Current: 32mA; Schmitt Trigger Input: No; Min Supply Voltage: 1.5V; Height: 1.45mm; Mounting Technology: Surface Mount; Thickness: 1.2mm; Termination: SMD/SMT; Output Current: 32mA; Max Operating Temperature: 125°C; Length: 2.9mm; Max Output current: 32mA; Quiescent Current: 10µA; Ambient Temperature Range High: 125°C; Width: 1.6mm; Number of Input Lines: 2; Number of Outputs: 1; Number of Circuits: 1; Min Operating Temperature: -40°C; Number of Output Lines: 1; Number of Channels: 1; Logic Function: OR; Case/Package: SOT-23; Number of Elements: 1; Number of Gates: 1; Pins: 5; Turn-On Delay Time: 4.5ns
U508 = CMP-016-00011-2: 1-ch, 3-input 1.65-V to 5.5-V 32 mA drive strength AND gate 6-SOT-23 -40 to 125; Max Supply Voltage: 5.5V; Min Supply Voltage: 1.65V; Max Output current: 32mA; Number of Circuits: 1; Schmitt Trigger Input: No; Propagation Delay: 3.5ns; Quiescent Current: 10µA; Number of Inputs: 3; High Level Output Current: -32mA; Turn-On Delay Time: 4.9ns; Mounting Technology: Surface Mount; Thickness: 1.2mm; Min Operating Temperature: -40°C; Pins: 6; Max Operating Temperature: 125°C; Number of Bits: 1; Contact Plating: Tin; Low Level Output Current: 32mA; Width: 1.6mm; Length: 2.9mm; Height: 0m; Number of Elements: 1; Number of Outputs: 1; Output Current: 32mA; Termination: SMD/SMT; Number of Gates: 1; Case/Package: SOT-23; Number of Input Lines: 3; Number of Output Lines: 1; Number of Channels: 1
U509 = CMP-015-00009-4: RF Switch, SP6T, 10- 8000 MHz, .7 to 1.6 dB IL, 30- 68 dB Isolation, 4x4mm QFN; Max Supply Current: 200µA; Number of Circuits: 1; Ratings: MIL-STD-883; Insertion Loss (dB): 2.8dB; Impedance: 50Ω; Clock Frequency: 8GHz; Turn-On Delay Time: 210ns; Max Operating Temperature: 125°C; Min Operating Temperature: -55°C; Number of Terminals: 24; Mounting Technology: Surface Mount
U?#1 = CMP-019-00058-3: IC REG BUCK ADJ 1A DL 14DFN Buck Switching Regulator IC Positive Adjustable 0.6V 2 Output 1A 14-WFDFN Exposed Pad; Max Supply Voltage: 17V; Number of Outputs: 2; Min Input Voltage: 2.7V; Max Junction Temperature (Tj): 125°C; Min Output Voltage: 600mV; Max Duty Cycle: 100%; Synchronous Rectifier: Yes; Switching Frequency: 2.25MHz; Topology: Buck; Output Configuration: Positive; Min Operating Temperature: -40°C; Max Operating Temperature: 125°C; Current - Output 1: 1A; Current - Output 2: 1A; Voltage - Output 2: 17V; Voltage - Output 1: 17V; Height: 800µm; Lifecycle Status: Production; Min Supply Voltage: 2.7V; Max Output Voltage: 17V; Mounting Technology: Surface Mount; Pins: 14; Output Type: Adjustable; Case/Package: 14-DFN (4x3); Output Current: 1A
U?#2 U?#11 = CMP-020-00024-4: RISC Microcontroller, 32-Bit, FLASH, Cortex-M0+ CPU, 64MHz, CMOS, PQFP64; Number of ADC Channels: 19; Number of USB Channels: 1; Number of USART Channels: 4; Number of Channels: 16; Max Supply Voltage: 3.6V; Operating Supply Voltage: 3V; Max Junction Temperature (Tj): 105°C; Min Supply Voltage: 1.7V; Number of Timers/Counters: 12; Flash Memory Size: 128kB; Number of I/Os: 5; Interface: I2S; EEPROM Memory Size: 0B; Data Bus Width: 32b; Number of D/A Converters: 2; Number of Interrupts: 60; RAM Size: 36kB; Max Supply Current: 7mA; Core Architecture: ARM Cortex-M0+; ADC Channels (Resolution): 16-Ch 12-Bit; Nominal Supply Voltage (DC): 1.8V; DAC Channels (Resolution): 2-Ch 12-Bit; Peripherals: POR, PWM, WDT; Clock Frequency: 48MHz; Memory Format: FLASH; Height: 1.6mm; Frequency: 64MHz; Terminal Pitch: 500µm; Case/Package: 64-LQFP (10x10); Number of UART Channels: 1; Length: 10mm; Min Operating Temperature: -40°C; Height - Seated (Max): 1.6mm; Memory Size: 128kB; Max Operating Temperature: 85°C; Number of SPI Channels: 2; Number of I2C Channels: 2; Width: 10mm; Number of Terminals: 64; Number of A/D Converters: 1; Temperature Grade: Industrial
U?#3 U?#4 = CMP-001-0001-2: Quectel L76K GPS/GNSS module
U?#5 U?#9 = CMP-015-00010-5: USB Type-C Configuration Channel Logic and Port Control with VCONN 12-X2QFN -40 to 85; Max Supply Voltage: 5.5V; Min Supply Voltage: 4.5V; USB Standard: USB 1.0; Nominal Supply Current: 70µA; Number of Ports: 1; Ambient Temperature Range High: 85°C; Pins: 12; Width: 1.6mm; Min Operating Temperature: -40°C; Interface: USB; Max Operating Temperature: 85°C; Height: 400µm; Thickness: 350µm; Length: 1.6mm; Mounting Technology: Surface Mount
U?#6 U?#10 = CMP-015-00011-7: Dual 2: 1 USB 2.0 Mux/DeMux or Single Ended Cross Switch with 20-V OVP 12-DSBGA -40 to 85; Number of Channels: 2; Min Operating Temperature: -40°C; Pins: 12; Max Operating Temperature: 85°C
U?#7 = CMP-019-00056-3: LDL112 Series 3.3V 1.2A Low Quiescent Current LDO Reverse Current Protect DFN-6; Quiescent Current: 400µA; Polarity: Positive; Number of Circuits: 1; Accuracy: 2%; Operating Supply Current: 250µA; Voltage Tolerance: 3%; Max Junction Temperature (Tj): 125°C; Max Supply Voltage: 5.5V; Output Type: Fixed; Dropout Voltage: 350mV; Min Input Voltage: 3.8V; Max Output current: 5A; Min Operating Temperature: -40°C; Height - Seated (Max): 1mm; Number of Regulators: 1; Number of Outputs: 1; Number of Channels: 1; Output Current: 1.2A; Tolerance: 2%; Terminal Pitch: 950µm; Number of Terminals: 6; Output Voltage: 3.3V; Mounting Technology: Surface Mount; Case/Package: 6-DFN (3x3); Max Operating Temperature: 125°C; Pins: 6; Length: 3mm; Width: 3mm
U?#8 = CMP-019-00054-3: 4.2-V TO 18-V, 3-A, SYNCHRONOUS / Buck Switching Regulator IC Positive Adjustable 0.6V 1 Output 3A SOT-583; Number of Channels: 1; Height: 0m; Length: 2.1mm; Width: 1.2mm; Pins: 8; Topology: Buck; Thickness: 550µm
U?#12 = CMP-019-00053-5: Switching Regulator, Current-mode, 7.75A, 2500kHz Switching Freq-Max, BICMOS, PQCC16; Manufacturer Lifecycle Status: ACTIVE; Max Duty Cycle: 96%; Max Supply Voltage: 38V; Number of Outputs: 1; Switching Frequency: 2.55MHz; Topology: Boost, Flyback, SEPIC; Output Current: 5.25A; Min Output Voltage: 2.9V; Synchronous Rectifier: No; Quiescent Current: 500µA; Output Type: Adjustable; Max Output current: 5A; Max Junction Temperature (Tj): 150°C; Min Operating Temperature: -40°C; Pins: 16; Length: 3mm; Thickness: 750µm; Mounting Technology: Surface Mount; Height: 800µm; Operating Supply Voltage: 38V; Ambient Temperature Range High: 125°C; Output Voltage: 38V; Contact Plating: Gold; Min Input Voltage: 2.9V; Width: 3mm; Max Output Voltage: 38V; Min Supply Voltage: 2.9V; Max Operating Temperature: 125°C; Nominal Supply Current: 500µA; Case/Package: 16-WQFN (3x3)
Y? = CMP-003-00030-1: Passive Crystal Oscillators 8MHz ±50ppm 8pF 500Ω SMD3225_2P SMT -40℃~+150℃; Frequency Stability: 150ppm; Frequency Tolerance: 0.005%; sch_layout_lock: 1; sch_layout_dnp: 0; Pins: 2; Length: 3.2004mm; REACH SVHC: Yes; Min Operating Temperature: -40°C; ESR (Equivalent Series Resistance): 500Ω; Width: 2.4892mm; Height: 990.6µm; Frequency: 8MHz; Case/Package: SMD/SMT; Max Operating Temperature: 150°C; ESR: 500Ω; Mounting Technology: Surface Mount; Load Capacitance: 8pF